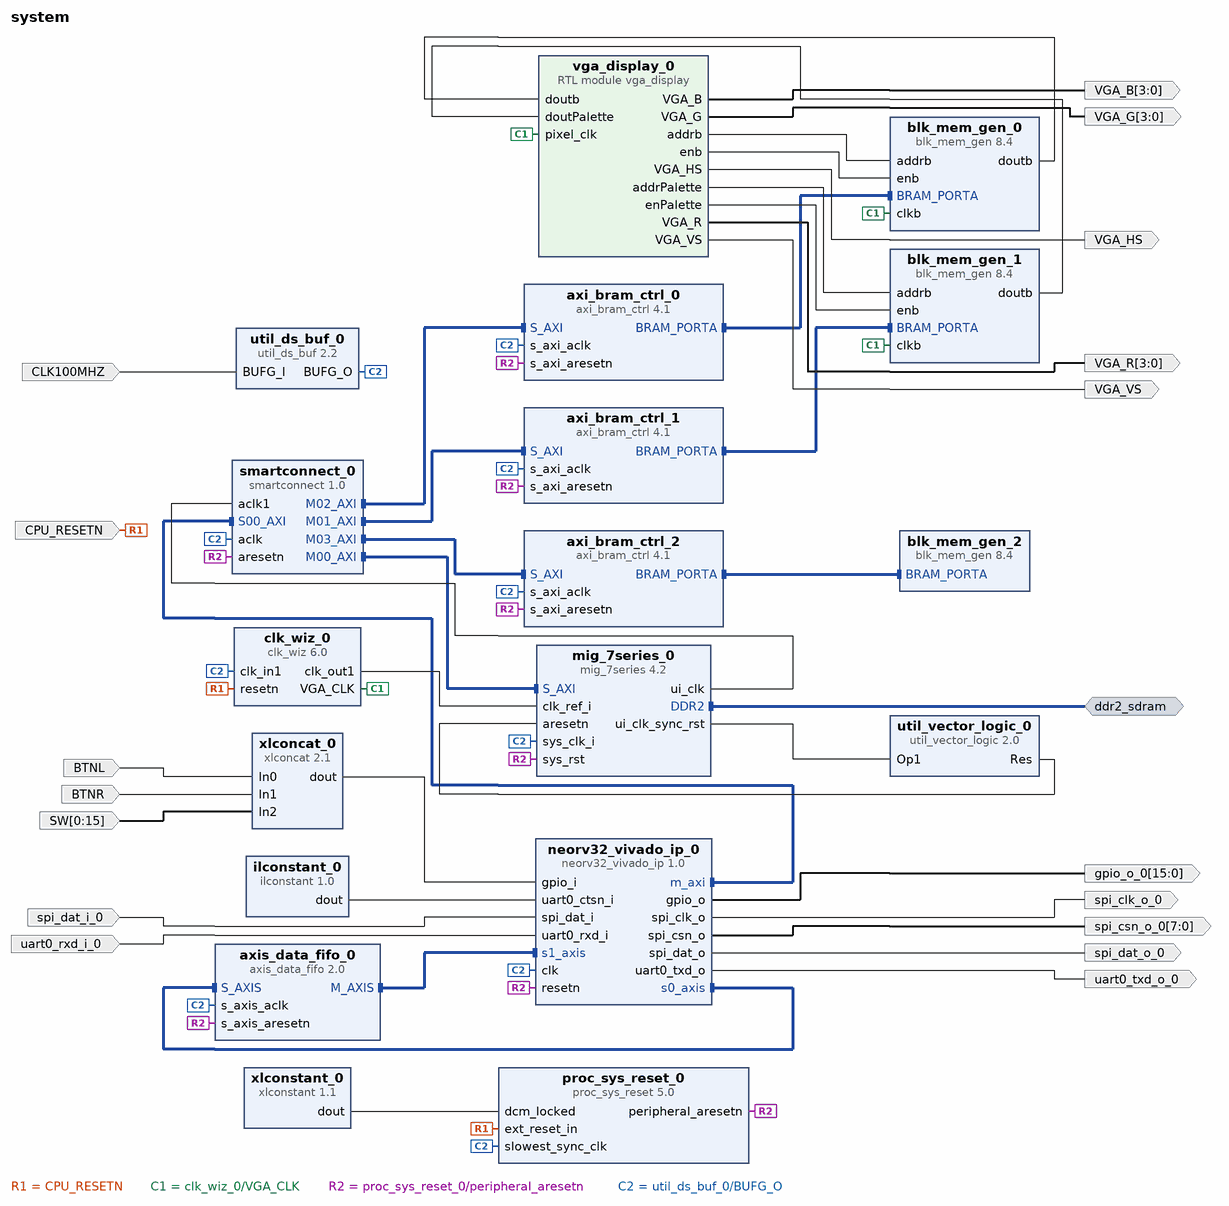
[diagram p0: block diagram of the top level]
# Vivado block design system, xc7a100tcsg324-1, Vivado 2025.1
create_bd_design system

create_bd_intf_port -mode Master -vlnv xilinx.com:interface:ddrx_rtl:1.0 ddr2_sdram
create_bd_port -dir I -type clk CLK100MHZ
set_property -dict {CONFIG.FREQ_HZ 100000000} [get_bd_ports CLK100MHZ]
create_bd_port -dir I CPU_RESETN
create_bd_port -dir I -from 0 -to 15 SW
create_bd_port -dir I BTNL
create_bd_port -dir I BTNR
create_bd_port -dir I uart0_rxd_i_0
create_bd_port -dir O uart0_txd_o_0
create_bd_port -dir O spi_clk_o_0
create_bd_port -dir O spi_dat_o_0
create_bd_port -dir I spi_dat_i_0
create_bd_port -dir O -from 7 -to 0 spi_csn_o_0
create_bd_port -dir O -from 15 -to 0 gpio_o_0
create_bd_port -dir O -from 3 -to 0 VGA_R
create_bd_port -dir O -from 3 -to 0 VGA_G
create_bd_port -dir O -from 3 -to 0 VGA_B
create_bd_port -dir O VGA_HS
create_bd_port -dir O VGA_VS

create_bd_cell -type ip -vlnv NEORV32:user:neorv32_vivado_ip:1.0 neorv32_vivado_ip_0
set_property -dict [list \
  CONFIG.BOOT_MODE_SELECT 0 \
  CONFIG.CACHE_BURSTS_EN true \
  CONFIG.DCACHE_EN true \
  CONFIG.DMEM_EN false \
  CONFIG.ICACHE_EN true \
  CONFIG.IMEM_EN true \
  CONFIG.IMEM_OUTREG_EN true \
  CONFIG.IMEM_SIZE 32768 \
  CONFIG.IO_CFS_EN false \
  CONFIG.IO_GPIO_EN true \
  CONFIG.IO_GPIO_IN_NUM 32 \
  CONFIG.IO_GPIO_OUT_NUM 16 \
  CONFIG.IO_SDI_EN false \
  CONFIG.IO_SLINK_EN true \
  CONFIG.IO_SPI_EN true \
  CONFIG.IO_UART0_EN true \
  CONFIG.IO_UART0_RX_FIFO 64 \
  CONFIG.IO_UART0_TX_FIFO 64 \
  CONFIG.RISCV_ISA_M true \
  CONFIG.XBUS_EN true \
  CONFIG.XBUS_REGSTAGE_EN true \
] [get_bd_cells neorv32_vivado_ip_0]
create_bd_cell -type ip -vlnv xilinx.com:ip:axis_data_fifo:2.0 axis_data_fifo_0
create_bd_cell -type ip -vlnv xilinx.com:ip:smartconnect:1.0 smartconnect_0
set_property -dict {CONFIG.NUM_CLKS 2 CONFIG.NUM_MI 4 CONFIG.NUM_SI 1} [get_bd_cells smartconnect_0]
create_bd_cell -type ip -vlnv xilinx.com:ip:xlconcat:2.1 xlconcat_0
set_property -dict {CONFIG.NUM_PORTS 3} [get_bd_cells xlconcat_0]
create_bd_cell -type ip -vlnv xilinx.com:ip:axi_bram_ctrl:4.1 axi_bram_ctrl_0
set_property -dict {CONFIG.SINGLE_PORT_BRAM 1} [get_bd_cells axi_bram_ctrl_0]
create_bd_cell -type ip -vlnv xilinx.com:ip:blk_mem_gen:8.4 blk_mem_gen_0
set_property -dict {CONFIG.Memory_Type True_Dual_Port_RAM} [get_bd_cells blk_mem_gen_0]
create_bd_cell -type ip -vlnv xilinx.com:ip:axi_bram_ctrl:4.1 axi_bram_ctrl_1
set_property -dict {CONFIG.DATA_WIDTH 32 CONFIG.RD_CMD_OPTIMIZATION 0 CONFIG.SINGLE_PORT_BRAM 1} [get_bd_cells axi_bram_ctrl_1]
create_bd_cell -type ip -vlnv xilinx.com:ip:blk_mem_gen:8.4 blk_mem_gen_1
set_property -dict {CONFIG.Memory_Type True_Dual_Port_RAM} [get_bd_cells blk_mem_gen_1]
create_bd_cell -type ip -vlnv xilinx.com:ip:proc_sys_reset:5.0 proc_sys_reset_0
create_bd_cell -type ip -vlnv xilinx.com:ip:xlconstant:1.1 xlconstant_0
create_bd_cell -type ip -vlnv xilinx.com:ip:util_ds_buf:2.2 util_ds_buf_0
set_property -dict {CONFIG.C_BUF_TYPE BUFG} [get_bd_cells util_ds_buf_0]
create_bd_cell -type inline_hdl -vlnv xilinx.com:inline_hdl:ilconstant:1.0 ilconstant_0
set_property -dict {CONFIG.CONST_VAL 0} [get_bd_cells ilconstant_0]
create_bd_cell -type ip -vlnv xilinx.com:ip:mig_7series:4.2 mig_7series_0
set_property -dict [list \
  CONFIG.BOARD_MIG_PARAM ddr2_sdram \
  CONFIG.MIG_DONT_TOUCH_PARAM Custom \
  CONFIG.RESET_BOARD_INTERFACE Custom \
  CONFIG.XML_INPUT_FILE mig_a.prj \
] [get_bd_cells mig_7series_0]
create_bd_cell -type ip -vlnv xilinx.com:ip:clk_wiz:6.0 clk_wiz_0
set_property -dict [list \
  CONFIG.CLKOUT1_JITTER 114.829 \
  CONFIG.CLKOUT1_REQUESTED_OUT_FREQ 200.000 \
  CONFIG.CLKOUT2_JITTER 175.402 \
  CONFIG.CLKOUT2_PHASE_ERROR 98.575 \
  CONFIG.CLKOUT2_REQUESTED_OUT_FREQ 25 \
  CONFIG.CLKOUT2_USED true \
  CONFIG.CLK_OUT2_PORT VGA_CLK \
  CONFIG.MMCM_CLKOUT0_DIVIDE_F 5.000 \
  CONFIG.MMCM_CLKOUT1_DIVIDE 40 \
  CONFIG.NUM_OUT_CLKS 2 \
  CONFIG.RESET_PORT resetn \
  CONFIG.RESET_TYPE ACTIVE_LOW \
] [get_bd_cells clk_wiz_0]
create_bd_cell -type ip -vlnv xilinx.com:ip:util_vector_logic:2.0 util_vector_logic_0
set_property -dict {CONFIG.C_OPERATION not CONFIG.C_SIZE 1} [get_bd_cells util_vector_logic_0]
create_bd_cell -type module -reference vga_display vga_display_0
create_bd_cell -type ip -vlnv xilinx.com:ip:axi_bram_ctrl:4.1 axi_bram_ctrl_2
set_property -dict {CONFIG.SINGLE_PORT_BRAM 1} [get_bd_cells axi_bram_ctrl_2]
create_bd_cell -type ip -vlnv xilinx.com:ip:blk_mem_gen:8.4 blk_mem_gen_2
set_property -dict {CONFIG.Memory_Type Single_Port_RAM} [get_bd_cells blk_mem_gen_2]

# ---- connections ----

connect_bd_intf_net [get_bd_intf_pins axi_bram_ctrl_0/BRAM_PORTA] [get_bd_intf_pins blk_mem_gen_0/BRAM_PORTA]
connect_bd_intf_net [get_bd_intf_pins axi_bram_ctrl_1/BRAM_PORTA] [get_bd_intf_pins blk_mem_gen_1/BRAM_PORTA]
connect_bd_intf_net [get_bd_intf_pins axi_bram_ctrl_2/BRAM_PORTA] [get_bd_intf_pins blk_mem_gen_2/BRAM_PORTA]
connect_bd_intf_net [get_bd_intf_pins axis_data_fifo_0/M_AXIS] [get_bd_intf_pins neorv32_vivado_ip_0/s1_axis]
connect_bd_intf_net [get_bd_intf_ports ddr2_sdram] [get_bd_intf_pins mig_7series_0/DDR2]
connect_bd_intf_net [get_bd_intf_pins neorv32_vivado_ip_0/m_axi] [get_bd_intf_pins smartconnect_0/S00_AXI]
connect_bd_intf_net [get_bd_intf_pins neorv32_vivado_ip_0/s0_axis] [get_bd_intf_pins axis_data_fifo_0/S_AXIS]
connect_bd_intf_net [get_bd_intf_pins smartconnect_0/M00_AXI] [get_bd_intf_pins mig_7series_0/S_AXI]
connect_bd_intf_net [get_bd_intf_pins smartconnect_0/M01_AXI] [get_bd_intf_pins axi_bram_ctrl_1/S_AXI]
connect_bd_intf_net [get_bd_intf_pins smartconnect_0/M02_AXI] [get_bd_intf_pins axi_bram_ctrl_0/S_AXI]
connect_bd_intf_net [get_bd_intf_pins smartconnect_0/M03_AXI] [get_bd_intf_pins axi_bram_ctrl_2/S_AXI]
connect_bd_net -net BTNC_1 [get_bd_ports CPU_RESETN] [get_bd_pins proc_sys_reset_0/ext_reset_in] [get_bd_pins clk_wiz_0/resetn]
connect_bd_net [get_bd_ports BTNL] [get_bd_pins xlconcat_0/In0]
connect_bd_net [get_bd_ports BTNR] [get_bd_pins xlconcat_0/In1]
connect_bd_net [get_bd_ports CLK100MHZ] [get_bd_pins util_ds_buf_0/BUFG_I]
connect_bd_net [get_bd_ports SW] [get_bd_pins xlconcat_0/In2]
connect_bd_net [get_bd_pins blk_mem_gen_0/doutb] [get_bd_pins vga_display_0/doutb]
connect_bd_net [get_bd_pins blk_mem_gen_1/doutb] [get_bd_pins vga_display_0/doutPalette]
connect_bd_net [get_bd_pins clk_wiz_0/VGA_CLK] [get_bd_pins blk_mem_gen_0/clkb] [get_bd_pins blk_mem_gen_1/clkb] [get_bd_pins vga_display_0/pixel_clk]
connect_bd_net [get_bd_pins clk_wiz_0/clk_out1] [get_bd_pins mig_7series_0/clk_ref_i]
connect_bd_net [get_bd_pins ilconstant_0/dout] [get_bd_pins neorv32_vivado_ip_0/uart0_ctsn_i]
connect_bd_net [get_bd_pins mig_7series_0/ui_clk] [get_bd_pins smartconnect_0/aclk1]
connect_bd_net [get_bd_pins mig_7series_0/ui_clk_sync_rst] [get_bd_pins util_vector_logic_0/Op1]
connect_bd_net [get_bd_pins neorv32_vivado_ip_0/gpio_o] [get_bd_ports gpio_o_0]
connect_bd_net [get_bd_pins neorv32_vivado_ip_0/spi_clk_o] [get_bd_ports spi_clk_o_0]
connect_bd_net [get_bd_pins neorv32_vivado_ip_0/spi_csn_o] [get_bd_ports spi_csn_o_0]
connect_bd_net [get_bd_pins neorv32_vivado_ip_0/spi_dat_o] [get_bd_ports spi_dat_o_0]
connect_bd_net [get_bd_pins neorv32_vivado_ip_0/uart0_txd_o] [get_bd_ports uart0_txd_o_0]
connect_bd_net [get_bd_pins proc_sys_reset_0/peripheral_aresetn] \
  [get_bd_pins smartconnect_0/aresetn] [get_bd_pins axi_bram_ctrl_0/s_axi_aresetn] \
  [get_bd_pins axi_bram_ctrl_1/s_axi_aresetn] [get_bd_pins axis_data_fifo_0/s_axis_aresetn] \
  [get_bd_pins mig_7series_0/sys_rst] [get_bd_pins neorv32_vivado_ip_0/resetn] [get_bd_pins axi_bram_ctrl_2/s_axi_aresetn]
connect_bd_net -net spi_dat_i_0_1 [get_bd_ports spi_dat_i_0] [get_bd_pins neorv32_vivado_ip_0/spi_dat_i]
connect_bd_net -net uart0_rxd_i_0_1 [get_bd_ports uart0_rxd_i_0] [get_bd_pins neorv32_vivado_ip_0/uart0_rxd_i]
connect_bd_net [get_bd_pins util_ds_buf_0/BUFG_O] \
  [get_bd_pins axis_data_fifo_0/s_axis_aclk] [get_bd_pins proc_sys_reset_0/slowest_sync_clk] \
  [get_bd_pins smartconnect_0/aclk] [get_bd_pins axi_bram_ctrl_0/s_axi_aclk] [get_bd_pins axi_bram_ctrl_1/s_axi_aclk] \
  [get_bd_pins clk_wiz_0/clk_in1] [get_bd_pins mig_7series_0/sys_clk_i] [get_bd_pins neorv32_vivado_ip_0/clk] \
  [get_bd_pins axi_bram_ctrl_2/s_axi_aclk]
connect_bd_net [get_bd_pins util_vector_logic_0/Res] [get_bd_pins mig_7series_0/aresetn]
connect_bd_net [get_bd_pins vga_display_0/VGA_B] [get_bd_ports VGA_B]
connect_bd_net [get_bd_pins vga_display_0/VGA_G] [get_bd_ports VGA_G]
connect_bd_net [get_bd_pins vga_display_0/VGA_HS] [get_bd_ports VGA_HS]
connect_bd_net [get_bd_pins vga_display_0/VGA_R] [get_bd_ports VGA_R]
connect_bd_net [get_bd_pins vga_display_0/VGA_VS] [get_bd_ports VGA_VS]
connect_bd_net [get_bd_pins vga_display_0/addrPalette] [get_bd_pins blk_mem_gen_1/addrb]
connect_bd_net [get_bd_pins vga_display_0/addrb] [get_bd_pins blk_mem_gen_0/addrb]
connect_bd_net [get_bd_pins vga_display_0/enPalette] [get_bd_pins blk_mem_gen_1/enb]
connect_bd_net [get_bd_pins vga_display_0/enb] [get_bd_pins blk_mem_gen_0/enb]
connect_bd_net [get_bd_pins xlconcat_0/dout] [get_bd_pins neorv32_vivado_ip_0/gpio_i]
connect_bd_net [get_bd_pins xlconstant_0/dout] [get_bd_pins proc_sys_reset_0/dcm_locked]

# ---- address map ----
assign_bd_address -offset 0x80000000 -range 256K -target_address_space [get_bd_addr_spaces neorv32_vivado_ip_0/m_axi] [get_bd_addr_segs axi_bram_ctrl_2/S_AXI/Mem0]
assign_bd_address -offset 0x90000000 -range 4M -target_address_space [get_bd_addr_spaces neorv32_vivado_ip_0/m_axi] [get_bd_addr_segs mig_7series_0/memmap/memaddr]
assign_bd_address -offset 0xC0000000 -range 128K -target_address_space [get_bd_addr_spaces neorv32_vivado_ip_0/m_axi] [get_bd_addr_segs axi_bram_ctrl_0/S_AXI/Mem0]
assign_bd_address -offset 0xC2000000 -range 4K -target_address_space [get_bd_addr_spaces neorv32_vivado_ip_0/m_axi] [get_bd_addr_segs axi_bram_ctrl_1/S_AXI/Mem0]

validate_bd_design
save_bd_design
